# Altium schematic sheet MAIN.SchDoc: =VariantName
size 274 x 177 mm; SheetNumber: 1; SheetTotal: 7
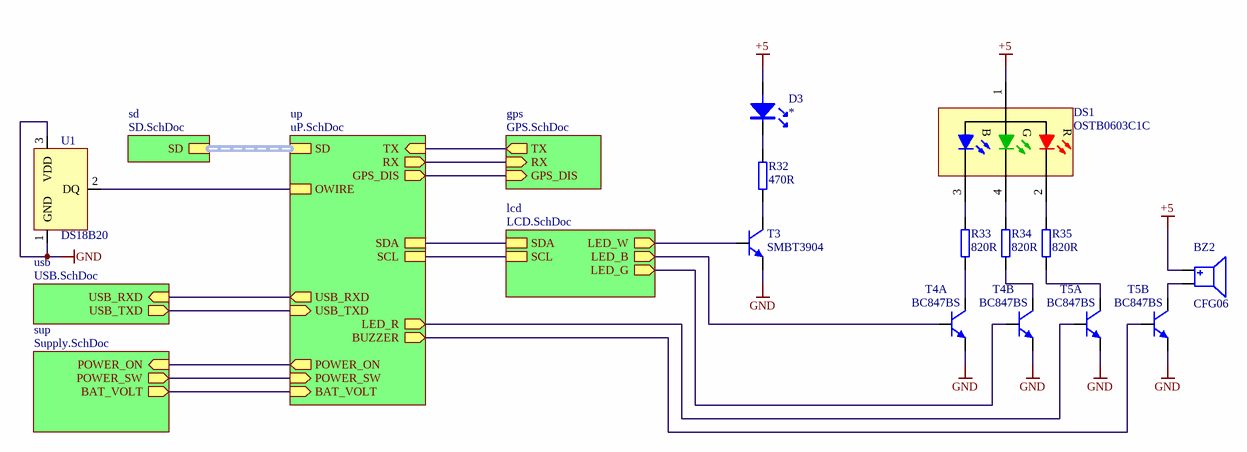
[diagram p0: MAIN.SchDoc]

## Parts
BZ2  CFG06  [CFG-06]
D3  *  [LED_0805]
DS1  OSTB0603C1C  [LED0603_4]
R32  470R  [R0805]
R33  820R  [R0805]
R34  820R  [R0805]
R35  820R  [R0805]
T3  SMBT3904  [SOT23J]
T4  BC847BS  [SOT363]  (parts A,B of 2)
T5  BC847BS  [SOT363]  (parts A,B of 2)
U1  DS18B20  [TO-92]

## Sub-sheets
gps = GPS.SchDoc: TX (out), RX (in), GPS_DIS (in)
lcd = LCD.SchDoc: SDA, SCL, LED_G (out), LED_B (out), LED_W (out)
sd = SD.SchDoc: SD
sup = Supply.SchDoc: POWER_ON (in), POWER_SW (out), BAT_VOLT (out)
up = uP.SchDoc: TX (in), RX (out), SDA, OWIRE, SCL, USB_TXD (in), USB_RXD (out), SD (harness SD), GPS_DIS (out), BUZZER (out), LED_R (out), POWER_ON (out), POWER_SW (in), BAT_VOLT (in)
usb = USB.SchDoc: USB_TXD (out), USB_RXD (in)

## Nets
+5: BZ2.+ D3.A DS1.1(A2)
GND: T3.1(E) T4.1(E1) T4.4(E2) T5.1(E1) T5.4(E2) U1.1(GND) U1.3(VDD)
NetBZ2_-: BZ2.- T5.6(C2)
NetD3_K: D3.K R32.2
NetDS1_2: DS1.2(R) R35.1
NetDS1_3: DS1.3(B) R33.1
NetDS1_4: DS1.4(G) R34.1
NetR32_1: R32.1 T3.3(C)
NetR33_2: R33.2 T4.3(C1)
NetR34_2: R34.2 T4.6(C2)
NetR35_2: R35.2 T5.3(C1)
NetT3_2: T3.2(B) ; sheet lcd/LED_W
NetT4_2: T4.2(B1) ; sheet lcd/LED_B
NetT4_5: T4.5(B2) ; sheet lcd/LED_G
NetT5_2: T5.2(B1) ; sheet up/LED_R
NetT5_5: T5.5(B2) ; sheet up/BUZZER
NetU1_2: U1.2(DQ) ; sheet up/OWIRE
(unnamed): sheet gps/TX, sheet up/TX
(unnamed): sheet gps/RX, sheet up/RX
(unnamed): sheet gps/GPS_DIS, sheet up/GPS_DIS
(unnamed): sheet up/SDA, sheet lcd/SDA
(unnamed): sheet up/SCL, sheet lcd/SCL
(unnamed): sheet up/USB_TXD, sheet usb/USB_TXD
(unnamed): sheet up/USB_RXD, sheet usb/USB_RXD
(unnamed): sheet up/POWER_ON, sheet sup/POWER_ON
(unnamed): sheet up/POWER_SW, sheet sup/POWER_SW
(unnamed): sheet up/BAT_VOLT, sheet sup/BAT_VOLT

## Buses and harness runs
harness sheet sd/SD = sheet up/SD

## Notes on the sheet
- Name:
- Device:
- File:

## Library data of the parts
BZ2 = CFG06: BUZZER;; Indeks: MAKB002; P&P: 0; Value: CFG06
D3 = LED: LED;; Indeks: *; Value: *; P&P: *
DS1 = OPTOSUPPLY OSTB0603C1C: LED, RGB, SMD; Indeks: MOPSL068; Obudowa: LED0603; P&P: 1; Value: OSTB0603C1C
R32-R35 = R: R; resistor; Indeks: *; P&P: *
  R32: Value: 470R
  R33-R35: Value: 820R
T3 = SMBT3904: T_NPN; Bipolar Transistor; Indeks: MTRSB002; P&P: 1; Value: SMBT3904
T4 T5 = BC847BS: T_NPN; Bipolar Transistor; pin to pad: 3>6 6>3; Indeks: MTRSB057; P&P: 1; Value: BC847BS
U1 = DS18B20: temperature sensor; Indeks: MUKTC049; P&P: 0; Value: DS18B20